# Altium project Elkapod_power_supply_converter_module.PrjPcb (part 1 of 4)
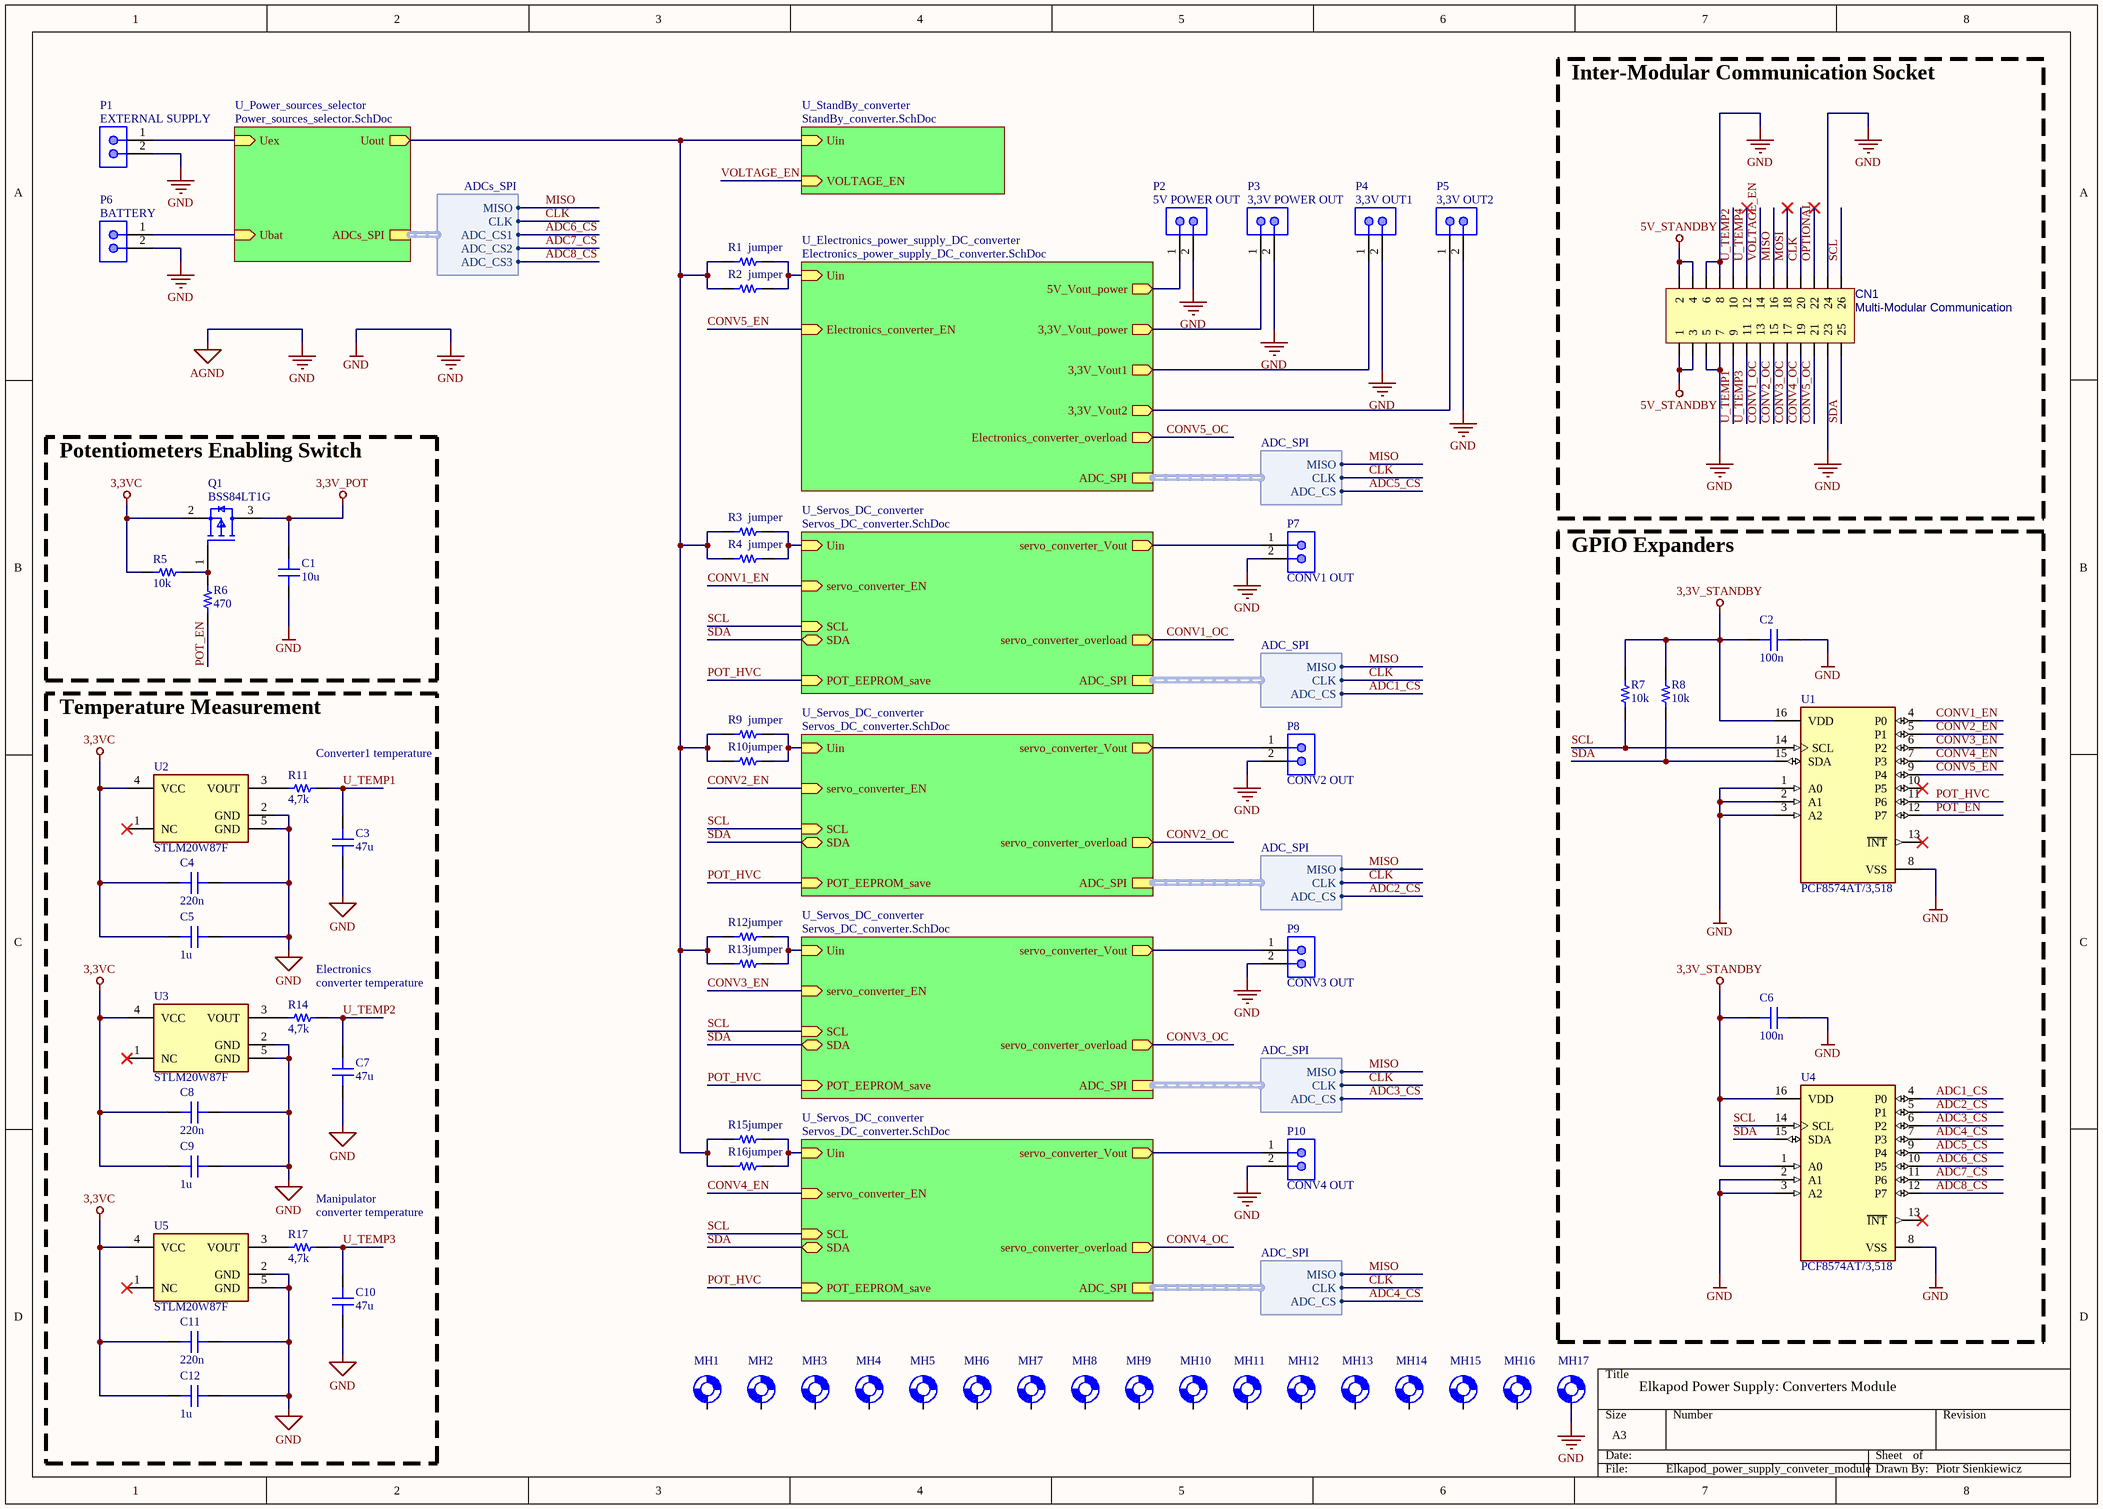
[diagram p0: Elkapod_power_supply_conveter_module.SchDoc]
6 sheets, 606 parts. Net scope: hierarchical (ports join the sheet entries above them; power ports are global).
Board file: Elkapod_power_supply_converter_module_PCB.PcbDoc
Sheets:
  Elkapod_power_supply_conveter_module.SchDoc
    U_Power_sources_selector = Power_sources_selector.SchDoc
      U_Current_measurement_circuit = Current_measurement_circuit.SchDoc
    U_StandBy_converter = StandBy_converter.SchDoc
    U_Servos_DC_converter = Servos_DC_converter.SchDoc
    U_Electronics_power_supply_DC_converter = Electronics_power_supply_DC_converter.SchDoc
    U_Servos_DC_converter = Servos_DC_converter.SchDoc
    U_Servos_DC_converter = Servos_DC_converter.SchDoc
    U_Servos_DC_converter = Servos_DC_converter.SchDoc

## Sheet Elkapod_power_supply_conveter_module.SchDoc: Elkapod Power Supply Block Diagram
size A3; SheetNumber: 1; SheetTotal: 6

### Parts
C1  10u  [CAP 0603_1608]
C2  100n  [CAP 0603_1608]
C3  47u  [CAP 0603_1608]
C4  220n  [CAP 0603_1608]
C5  1u  [CAP 0603_1608]
C6  100n  [CAP 0603_1608]
C7  47u  [CAP 0603_1608]
C8  220n  [CAP 0603_1608]
C9  1u  [CAP 0603_1608]
C10  47u  [CAP 0603_1608]
C11  220n  [CAP 0603_1608]
C12  1u  [CAP 0603_1608]
CN1  Multi-Modular Communication  [GP_13x2_F]
MH1  M3 Mounting Hole  [M3_MOUNTING_HOLE]  (value not drawn)
MH2  M3 Mounting Hole  [M3_MOUNTING_HOLE]  (value not drawn)
MH3  M3 Mounting Hole  [M3_MOUNTING_HOLE]  (value not drawn)
MH4  M3 Mounting Hole  [M3_MOUNTING_HOLE]  (value not drawn)
MH5  M3 Mounting Hole  [M3_MOUNTING_HOLE]  (value not drawn)
MH6  M3 Mounting Hole  [M3_MOUNTING_HOLE]  (value not drawn)
MH7  M3 Mounting Hole  [M3_MOUNTING_HOLE]  (value not drawn)
MH8  M3 Mounting Hole  [M3_MOUNTING_HOLE]  (value not drawn)
MH9  M3 Mounting Hole  [M3_MOUNTING_HOLE]  (value not drawn)
MH10  M3 Mounting Hole  [M3_MOUNTING_HOLE]  (value not drawn)
MH11  M3 Mounting Hole  [M3_MOUNTING_HOLE]  (value not drawn)
MH12  M3 Mounting Hole  [M3_MOUNTING_HOLE]  (value not drawn)
MH13  M3 Mounting Hole  [M3_MOUNTING_HOLE]  (value not drawn)
MH14  M3 Mounting Hole  [M3_MOUNTING_HOLE]  (value not drawn)
MH15  M3 Mounting Hole  [M3_MOUNTING_HOLE]  (value not drawn)
MH16  M3 Mounting Hole  [M3_MOUNTING_HOLE]  (value not drawn)
MH17  M3 Mounting Hole  [M3_MOUNTING_HOLE]  (value not drawn)
P1  EXTERNAL SUPPLY  [XT60PB-M]
P2  5V POWER OUT  [2x2,5mm2_WIRE]
P3  3,3V POWER OUT  [2x2,5mm2_WIRE]
P4  3,3V OUT1  [2x2,5mm2_WIRE]
P5  3,3V OUT2  [2x2,5mm2_WIRE]
P6  BATTERY  [XT60PB-M]
P7  CONV1 OUT  [2x2,5mm2_WIRE]
P8  CONV2 OUT  [2x2,5mm2_WIRE]
P9  CONV3 OUT  [2x2,5mm2_WIRE]
P10  CONV4 OUT  [2x2,5mm2_WIRE]
Q1  BSS84LT1G  [FP-318-08-IPC_A]
R1  jumper  [STACKPOLE CSM2512]
R2  jumper  [STACKPOLE CSM2512]
R3  jumper  [STACKPOLE CSM2512]
R4  jumper  [STACKPOLE CSM2512]
R5  10k  [RES 0603_1608]
R6  470  [RES 0603_1608]
R7  10k  [RES 0603_1608]
R8  10k  [RES 0603_1608]
R9  jumper  [STACKPOLE CSM2512]
R10  jumper  [STACKPOLE CSM2512]
R11  4,7k  [RES 0603_1608]
R12  jumper  [STACKPOLE CSM2512]
R13  jumper  [STACKPOLE CSM2512]
R14  4,7k  [RES 0603_1608]
R15  jumper  [STACKPOLE CSM2512]
R16  jumper  [STACKPOLE CSM2512]
R17  4,7k  [RES 0603_1608]
U1  PCF8574AT/3,518  [FP-SOT162-1-MFG]
U2  STLM20W87F  [FP-SOT323-5L-7091413-MFG]
U3  STLM20W87F  [FP-SOT323-5L-7091413-MFG]
U4  PCF8574AT/3,518  [FP-SOT162-1-MFG]
U5  STLM20W87F  [FP-SOT323-5L-7091413-MFG]

### Blocks framed on the sheet
Inter-Modular Communication Socket: CN1
Potentiometers Enabling Switch: C1 Q1 R5 R6
GPIO Expanders: C2 C6 R7 R8 U1 U4
Temperature Measurement: C3-C5 C7-C12 R11 R14 R17 U2 U3 U5

### Sub-sheets
U_Electronics_power_supply_DC_converter = Electronics_power_supply_DC_converter.SchDoc: Uin (in), Electronics_converter_EN (in), Electronics_converter_overload (out), 3,3V_Vout2 (out), 3,3V_Vout1 (out), 3,3V_Vout_power (out), 5V_Vout_power (out), ADC_SPI (harness ADC_SPI)
U_Power_sources_selector = Power_sources_selector.SchDoc: Ubat (in), Uout (out), Uex (in), ADCs_SPI (harness ADCs_SPI)
U_Servos_DC_converter = Servos_DC_converter.SchDoc: Uin (in), servo_converter_EN (in), servo_converter_overload (out), servo_converter_Vout (out), POT_EEPROM_save (in), SDA (bidir), SCL (in), ADC_SPI (harness ADC_SPI)  | RF2_value: 2,7k; RF1_value: 1k; RF3_value: 910
U_Servos_DC_converter = Servos_DC_converter.SchDoc: Uin (in), servo_converter_EN (in), servo_converter_overload (out), servo_converter_Vout (out), POT_EEPROM_save (in), SDA (bidir), SCL (in), ADC_SPI (harness ADC_SPI)  | RF2_value: 2,7k; RF1_value: 1k; RF3_value: 910
U_Servos_DC_converter = Servos_DC_converter.SchDoc: Uin (in), servo_converter_EN (in), servo_converter_overload (out), servo_converter_Vout (out), POT_EEPROM_save (in), SDA (bidir), SCL (in), ADC_SPI (harness ADC_SPI)  | RF2_value: 2,7k; RF1_value: 1k; RF3_value: 910
U_Servos_DC_converter = Servos_DC_converter.SchDoc: Uin (in), servo_converter_EN (in), servo_converter_overload (out), servo_converter_Vout (out), POT_EEPROM_save (in), SDA (bidir), SCL (in), ADC_SPI (harness ADC_SPI)  | RF2_value: 6,8k; RF1_value: 3,3k; RF3_value: 1,3k
U_StandBy_converter = StandBy_converter.SchDoc: Uin (in), VOLTAGE_EN (in)

### Harnesses
ADC_SPI: MISO, CLK, ADC_CS
ADCs_SPI: MISO, CLK, ADC_CS1, ADC_CS2, ADC_CS3

### Nets
3,3V_POT: C1.2 Q1.3(D)
3,3V_STANDBY: C2.2 C6.2 R7.2 R8.2 U1.16(VDD) U4.1(A0) U4.16(VDD)
3,3VC: C4.2 C5.2 C8.2 C9.2 C11.2 C12.2 Q1.2(S) R5.1 U2.4(VCC) U3.4(VCC) U5.4(VCC)
5V_STANDBY: CN1.1 CN1.2 CN1.3 CN1.4
AGND: C1.1 C2.1 C3.1 C4.1 C5.1 C6.1 C7.1 C8.1 C9.1 C10.1 C11.1 C12.1 CN1.5 CN1.6 CN1.7 CN1.8 CN1.23 CN1.24 MH17.1 P1.2(-) P2.2(-) P3.2(-) P4.2(-) P5.2(-) P6.2(-) P7.2(-) P8.2(-) P9.2(-) P10.2(-) U1.1(A0) U1.2(A1) U1.3(A2) U1.8(VSS) U2.2(GND) U2.5(GND) U3.2(GND) U3.5(GND) U4.2(A1) U4.3(A2) U4.8(VSS) U5.2(GND) U5.5(GND)  [also labelled GND]
5V_Vout_power: P2.1(+) ; sheet U_Electronics_power_supply_DC_converter/5V_Vout_power
ADC1_CS: U4.4(P0) ; sheet U_Servos_DC_converter/ADC_SPI.ADC_CS
ADC2_CS: U4.5(P1) ; sheet U_Servos_DC_converter/ADC_SPI.ADC_CS
ADC3_CS: U4.6(P2) ; sheet U_Servos_DC_converter/ADC_SPI.ADC_CS
ADC4_CS: U4.7(P3) ; sheet U_Servos_DC_converter/ADC_SPI.ADC_CS
ADC5_CS: U4.9(P4) ; sheet U_Electronics_power_supply_DC_converter/ADC_SPI.ADC_CS
ADC6_CS: U4.10(P5) ; sheet U_Power_sources_selector/ADCs_SPI.ADC_CS1
ADC7_CS: U4.11(P6) ; sheet U_Power_sources_selector/ADCs_SPI.ADC_CS2
ADC8_CS: U4.12(P7) ; sheet U_Power_sources_selector/ADCs_SPI.ADC_CS3
CLK: CN1.20 ; sheet U_Electronics_power_supply_DC_converter/ADC_SPI.CLK, sheet U_Servos_DC_converter/ADC_SPI.CLK, sheet U_Power_sources_selector/ADCs_SPI.CLK
CONV1_EN: U1.4(P0) ; sheet U_Servos_DC_converter/servo_converter_EN
CONV1_OC: CN1.13 ; sheet U_Servos_DC_converter/servo_converter_overload
CONV2_EN: U1.5(P1) ; sheet U_Servos_DC_converter/servo_converter_EN
CONV2_OC: CN1.15 ; sheet U_Servos_DC_converter/servo_converter_overload
CONV3_EN: U1.6(P2) ; sheet U_Servos_DC_converter/servo_converter_EN
CONV3_OC: CN1.17 ; sheet U_Servos_DC_converter/servo_converter_overload
CONV4_EN: U1.7(P3) ; sheet U_Servos_DC_converter/servo_converter_EN
CONV4_OC: CN1.19 ; sheet U_Servos_DC_converter/servo_converter_overload
CONV5_EN: U1.9(P4) ; sheet U_Electronics_power_supply_DC_converter/Electronics_converter_EN
CONV5_OC: CN1.21 ; sheet U_Electronics_power_supply_DC_converter/Electronics_converter_overload
MISO: CN1.16 ; sheet U_Electronics_power_supply_DC_converter/ADC_SPI.MISO, sheet U_Servos_DC_converter/ADC_SPI.MISO, sheet U_Power_sources_selector/ADCs_SPI.MISO
MOSI: CN1.18  [project net MOSI_1]
OPTIONAL: CN1.22  [project net OPTIONAL_1]
POT_EN: R6.2 U1.12(P7)  [project net POT_EN_1]
POT_HVC: U1.11(P6) ; sheet U_Servos_DC_converter/POT_EEPROM_save, sheet U_Servos_DC_converter/POT_EEPROM_save, sheet U_Servos_DC_converter/POT_EEPROM_save, sheet U_Servos_DC_converter/POT_EEPROM_save
SCL: CN1.26 R7.1 U1.14(SCL) U4.14(SCL) ; sheet U_Servos_DC_converter/SCL, sheet U_Servos_DC_converter/SCL, sheet U_Servos_DC_converter/SCL, sheet U_Servos_DC_converter/SCL
SDA: CN1.25 R8.1 U1.15(SDA) U4.15(SDA) ; sheet U_Servos_DC_converter/SDA, sheet U_Servos_DC_converter/SDA, sheet U_Servos_DC_converter/SDA, sheet U_Servos_DC_converter/SDA
servo_converter_Vout: P7.1(+) ; sheet U_Servos_DC_converter/servo_converter_Vout
servo_converter_Vout: P8.1(+) ; sheet U_Servos_DC_converter/servo_converter_Vout  [a separate net that carries the same name]
servo_converter_Vout: P9.1(+) ; sheet U_Servos_DC_converter/servo_converter_Vout  [a separate net that carries the same name]
servo_converter_Vout: P10.1(+) ; sheet U_Servos_DC_converter/servo_converter_Vout  [a separate net that carries the same name]
U_SUP: R1.2 R2.2 R3.2 R4.2 R9.2 R10.2 R12.2 R13.2 R15.2 R16.2 ; sheet U_Power_sources_selector/Uout, sheet U_StandBy_converter/Uin
U_TEMP1: C3.2 CN1.9 R11.2  [project net U_TEMP1_1]
U_TEMP2: C7.2 CN1.10 R14.2  [project net U_TEMP2_1]
U_TEMP3: C10.2 CN1.11 R17.2  [project net U_TEMP3_1]
U_TEMP4: CN1.12  [project net U_TEMP4_1]
Uin: R1.1 R2.1 ; sheet U_Electronics_power_supply_DC_converter/Uin
Uin: R3.1 R4.1 ; sheet U_Servos_DC_converter/Uin  [a separate net that carries the same name]
Uin: R9.1 R10.1 ; sheet U_Servos_DC_converter/Uin  [a separate net that carries the same name]
Uin: R12.1 R13.1 ; sheet U_Servos_DC_converter/Uin  [a separate net that carries the same name]
Uin: R15.1 R16.1 ; sheet U_Servos_DC_converter/Uin  [a separate net that carries the same name]
VOLTAGE_EN: CN1.14 ; sheet U_StandBy_converter/VOLTAGE_EN
NetC47_2: P3.1(+) ; sheet U_Electronics_power_supply_DC_converter/3,3V_Vout_power
NetC52_2: P4.1(+) ; sheet U_Electronics_power_supply_DC_converter/3,3V_Vout1
NetC57_2: P5.1(+) ; sheet U_Electronics_power_supply_DC_converter/3,3V_Vout2
NetF2_1: P1.1(+) ; sheet U_Power_sources_selector/Uex
NetF3_1: P6.1(+) ; sheet U_Power_sources_selector/Ubat
NetQ1_1: Q1.1(G) R5.2 R6.1
NetR11_1: R11.1 U2.3(VOUT)
NetR14_1: R14.1 U3.3(VOUT)
NetR17_1: R17.1 U5.3(VOUT)

Not connected (* = marked no-connect by the designer): MH1 1; MH2 1; MH3 1; MH4 1; MH5 1; MH6 1; MH7 1; MH8 1; MH9 1; MH10 1; MH11 1; MH12 1; MH13 1; MH14 1; MH15 1; MH16 1; U1 10(P5)* 13(~{INT})*; U2 1(NC)*; U3 1(NC)*; U4 13(~{INT})*; U5 1(NC)*

### Notes on the sheet
- (near R11) Converter1 temperature
- (near R14) converter temperature
- (near R14) Electronics
- (near R17) converter temperature
- (near R17) Manipulator
- Elkapod Power Supply: Converters Module
- Piotr Sienkiewicz

### Library data of the parts
C1 = C0603C272F3GAC7867: CAP CER 10uF 35V X5R 0603; manufacturer: KEMET; Temperature Coefficient: C0G, NP0; Tolerance: ±1%; Voltage - Rated: 25V; Part Number: C0603C272F3GAC7867; Value: 10u; Applications: General Purpose; Capacitance: 10u; componentlink1description: Datasheet; componentlink1url: https://api.kemet.com/component-edge/download/datasheet/C0603C272F3GACTU.pdf; componentlink2description: DigiKey Link; componentlink2url: https://www.digikey.com/en/products/detail/kemet/C0603C272F3GAC7867/2200413; Device Package: 0603 (1608 Metric); Features: Low ESL; lastupdated: 09.02.2024 20:10:30; Lifecycle Status: Active; Minimum Order: 1; Mounting Type: Surface Mount, MLCC; Operating Temperature: -55°C ~ 125°C; Package / Case: 0603 (1608 Metric); packaging: TapeAndReel; partid: 2138; Part Status: Active; price: 0.40; series: SMD Comm C0G; Size / Dimension: 0.063" L x 0.031" W (1.60mm x 0.80mm); Thickness (Max): 0.034" (0.87mm)
C2 C6 = C0603C272F3GAC7867: CAP CER 100nF 25V X5R 0603; manufacturer: KEMET; Temperature Coefficient: C0G, NP0; Tolerance: ±1%; Part Number: C0603C272F3GAC7867; Value: 100n; Applications: General Purpose; Capacitance: 100n; componentlink1description: Datasheet; componentlink1url: https://api.kemet.com/component-edge/download/datasheet/C0603C272F3GACTU.pdf; componentlink2description: DigiKey Link; componentlink2url: https://www.digikey.com/en/products/detail/kemet/C0603C272F3GAC7867/2200413; Device Package: 0603 (1608 Metric); Features: Low ESL; lastupdated: 09.02.2024 20:10:30; Lifecycle Status: Active; Minimum Order: 1; Mounting Type: Surface Mount, MLCC; Operating Temperature: -55°C ~ 125°C; Package / Case: 0603 (1608 Metric); packaging: TapeAndReel; partid: 2138; Part Status: Active; price: 0.40; series: SMD Comm C0G; Size / Dimension: 0.063" L x 0.031" W (1.60mm x 0.80mm); Thickness (Max): 0.034" (0.87mm); Voltage - Rated: 25V
C3 C7 C10 = C0603C272F3GAC7867: CAP CER 47uF 6,3V X5R 0603; manufacturer: KEMET; Temperature Coefficient: C0G, NP0; Tolerance: ±1%; Voltage - Rated: 25V; Part Number: C0603C272F3GAC7867; Value: 47u; Applications: General Purpose; Capacitance: 47u; componentlink1description: Datasheet; componentlink1url: https://api.kemet.com/component-edge/download/datasheet/C0603C272F3GACTU.pdf; componentlink2description: DigiKey Link; componentlink2url: https://www.digikey.com/en/products/detail/kemet/C0603C272F3GAC7867/2200413; Device Package: 0603 (1608 Metric); Features: Low ESL; lastupdated: 09.02.2024 20:10:30; Lifecycle Status: Active; Minimum Order: 1; Mounting Type: Surface Mount, MLCC; Operating Temperature: -55°C ~ 125°C; Package / Case: 0603 (1608 Metric); packaging: TapeAndReel; partid: 2138; Part Status: Active; price: 0.40; series: SMD Comm C0G; Size / Dimension: 0.063" L x 0.031" W (1.60mm x 0.80mm); Thickness (Max): 0.034" (0.87mm)
C4 C8 C11 = C0603C272F3GAC7867: CAP CER 220nF 25V X5R 0603; manufacturer: KEMET; Temperature Coefficient: C0G, NP0; Tolerance: ±1%; Part Number: C0603C272F3GAC7867; Value: 220n; Applications: General Purpose; Capacitance: 220n; componentlink1description: Datasheet; componentlink1url: https://api.kemet.com/component-edge/download/datasheet/C0603C272F3GACTU.pdf; componentlink2description: DigiKey Link; componentlink2url: https://www.digikey.com/en/products/detail/kemet/C0603C272F3GAC7867/2200413; Device Package: 0603 (1608 Metric); Features: Low ESL; lastupdated: 09.02.2024 20:10:30; Lifecycle Status: Active; Minimum Order: 1; Mounting Type: Surface Mount, MLCC; Operating Temperature: -55°C ~ 125°C; Package / Case: 0603 (1608 Metric); packaging: TapeAndReel; partid: 2138; Part Status: Active; price: 0.40; series: SMD Comm C0G; Size / Dimension: 0.063" L x 0.031" W (1.60mm x 0.80mm); Thickness (Max): 0.034" (0.87mm); Voltage - Rated: 25V
C5 C9 C12 = C0603C272F3GAC7867: CAP CER 1uF 25V X5R 0603; manufacturer: KEMET; Temperature Coefficient: C0G, NP0; Tolerance: ±1%; Part Number: C0603C272F3GAC7867; Value: 1u; Applications: General Purpose; Capacitance: 1u; componentlink1description: Datasheet; componentlink1url: https://api.kemet.com/component-edge/download/datasheet/C0603C272F3GACTU.pdf; componentlink2description: DigiKey Link; componentlink2url: https://www.digikey.com/en/products/detail/kemet/C0603C272F3GAC7867/2200413; Device Package: 0603 (1608 Metric); Features: Low ESL; lastupdated: 09.02.2024 20:10:30; Lifecycle Status: Active; Minimum Order: 1; Mounting Type: Surface Mount, MLCC; Operating Temperature: -55°C ~ 125°C; Package / Case: 0603 (1608 Metric); packaging: TapeAndReel; partid: 2138; Part Status: Active; price: 0.40; series: SMD Comm C0G; Size / Dimension: 0.063" L x 0.031" W (1.60mm x 0.80mm); Thickness (Max): 0.034" (0.87mm); Voltage - Rated: 25V
CN1 = CN_13x2
P1 P6 = XT60PB-M: XT60UPB-M; 30A/500V straight female DC PCB socket (pin1 -> +, pin2 -> -)
P2-P5 P7-P10 = 2X2,5mm2_WIRE: 2x2,5mm2 wire pads
Q1 = CMP-1058-00762-2: MOSFET P-CH 50V 130MA SOT-23; Max Power Dissipation: 225mW; On-State Resistance: 10R; Nominal Vgs: 2V; Gate to Source Voltage (Vgs): 20V; Rise Time: 1ns; Turn-Off Delay Time: 16ns; Voltage Rating (DC): -50V; Turn-On Delay Time: 3.6ns; Number of Elements: 1; Current Rating: -130mA; Input Capacitance: 30pF; Threshold Voltage: -2V; Element Configuration: Single; Drain to Source Breakdown Voltage: 50V; Continuous Drain Current (ID): 130mA; Length: 0.119inch; Drain to Source Voltage (Vdss): 50V; Min Operating Temperature: -55°C; Contact Plating: Tin; Lead Free: Lead Free; Width: 0.055inch; Case/Package: SOT-23-3; Max Operating Temperature: 150°C; Halogen Free: Halogen Free; Radiation Hardening: No; Drain to Source Resistance: 10R; REACH SVHC: No SVHC; Power Dissipation: 225mW; Number of Pins: 3; Package Quantity: 1; Packaging: Tape and Reel; Fall Time: 1ns; Rds On Max: 10R; Height: 0.04inch
R1-R4 R9 R10 R12 R13 R15 R16 = CSM2512FT20L0: RES 0 OHM 1W 2512; manufacturer: Stackpole Electronics Inc; Power (Watts): 3W; Temperature Coefficient: ±50ppm/°C; Tolerance: ±1%; value: 20 mOhms; Part Number: CSM2512FT20L0; componentlink1description: Datasheet; componentlink1url: https://www.seielect.com/Catalog/SEI-CSM.PDF; componentlink2description: DigiKey Link; componentlink2url: https://www.digikey.com/en/products/detail/stackpole-electronics-inc/CSM2512FT20L0/6270239; Composition: Metal Element; Device Package: 2512 (6332 Metric); Features: Current Sense; Height - Seated (Max): 0.035" (0.90mm); lastupdated: 03.06.2024 20:27:03; Lifecycle Status: Active; Minimum Order: 4000; Number of Terminations: 2; Operating Temperature: -55°C ~ 170°C; Package / Case: 2512 (6332 Metric); packaging: TapeAndReel; Part Status: Active; price: 0.19; Resistance: jumper; series: CSM; Size / Dimension: 0.252" L x 0.126" W (6.40mm x 3.20mm); Supplier Device Package: 2512
R5 R7 R8 = RNCS0603BKE10K0: RES 10K OHM 1% 0,1W 0603; Manufacturer: Stackpole Electronics Inc; Power (Watts): 0.063W, 1/16W; Temperature Coefficient: ±25ppm/°C; Tolerance: ±0.1%; Part Number: RNCS0603BKE10K0; Value: 10k; Composition: Thin Film; Device Package: 0603 (1608 Metric); Features: Anti-Corrosive, Automotive AEC-Q200, Moisture Resistant; Height - Seated (Max): 0.022" (0.55mm); LastUpdated: 09.02.2024 20:43:37; Lifecycle Status: Active; Minimum Order: 1; Number of Terminations: 2; Operating Temperature: -55°C ~ 155°C; Package / Case: 0603 (1608 Metric); Packaging: TapeAndReel; PartId: 4838; Part Status: Active; Price: 0.06; Ratings: AEC-Q200; Resistance: 10k; Series: RNCS; Size / Dimension: 0.061" L x 0.031" W (1.55mm x 0.80mm); Supplier Device Package: 0603
R6 = RNCS0603BKE10K0: RES 470 OHM 1% 0,1W 0603; Manufacturer: Stackpole Electronics Inc; Power (Watts): 0.063W, 1/16W; Temperature Coefficient: ±25ppm/°C; Tolerance: ±0.1%; Part Number: RNCS0603BKE10K0; Value: 470; Composition: Thin Film; Device Package: 0603 (1608 Metric); Features: Anti-Corrosive, Automotive AEC-Q200, Moisture Resistant; Height - Seated (Max): 0.022" (0.55mm); LastUpdated: 09.02.2024 20:43:37; Lifecycle Status: Active; Minimum Order: 1; Number of Terminations: 2; Operating Temperature: -55°C ~ 155°C; Package / Case: 0603 (1608 Metric); Packaging: TapeAndReel; PartId: 4838; Part Status: Active; Price: 0.06; Ratings: AEC-Q200; Resistance: 470; Series: RNCS; Size / Dimension: 0.061" L x 0.031" W (1.55mm x 0.80mm); Supplier Device Package: 0603
R11 R14 R17 = RNCS0603BKE10K0: RES 4,7K OHM 1% 0,1W 0603; Manufacturer: Stackpole Electronics Inc; Power (Watts): 0.063W, 1/16W; Temperature Coefficient: ±25ppm/°C; Tolerance: ±0.1%; Part Number: RNCS0603BKE10K0; Value: 4,7k; Composition: Thin Film; Device Package: 0603 (1608 Metric); Features: Anti-Corrosive, Automotive AEC-Q200, Moisture Resistant; Height - Seated (Max): 0.022" (0.55mm); LastUpdated: 09.02.2024 20:43:37; Lifecycle Status: Active; Minimum Order: 1; Number of Terminations: 2; Operating Temperature: -55°C ~ 155°C; Package / Case: 0603 (1608 Metric); Packaging: TapeAndReel; PartId: 4838; Part Status: Active; Price: 0.06; Ratings: AEC-Q200; Resistance: 4,7k; Series: RNCS; Size / Dimension: 0.061" L x 0.031" W (1.55mm x 0.80mm); Supplier Device Package: 0603
U1 U4 = CMP-10112-000003-1: IC I/O EXPANDER I2C 8B 16SOIC; Manufacturer: NXP Semiconductors; Interface: I2C,SMBus; Frequency: 100kHz; Nominal Supply Current: 40uA; Max Supply Voltage: 6V; Number Of I/Os: 8; Max Junction Temp: +125°C; Min Supply Voltage: 2.5V; Standoff Height: 0.1mm; RoHS: TRUE; Category: IC; Temperature: -40°C to +85°C; Device Class L3: I/O Expanders; ComponentLink2Description: Datasheet; ComponentLink2URL: https://www.nxp.com/docs/en/data-sheet/PCF8574_PCF8574A.pdf; Digikey Description: IC I/O EXPANDER I2C 8B 16SOIC; Ipc Land Pattern Name: SOIC127P1032X265-16; Mouser Description: PCF8574 Series 2.5 to 6V Remote 8-bit I/O Expander for I2C-bus -SOIC-16; Footprint Url: https://www.nxp.com/docs/en/package-information/SOT162-1.pdf; Lead Free: Yes; Device Class L2: Interface ICs; Ambient Temperature Range Low: -40°C; Temperature Range High: +85°C; Automotive: No; Manufacturer Part Number: PCF8574AT/3,518; Ambient Temperature Range High: +85°C; Height: 2.65mm; Package: SOT162-1; Temperature Range Low: -40°C; Octopart: https://octopart.com/pcf8574at%2F3%2C518-nxp+semiconductors-11541925; Device Class L1: Integrated Circuits (ICs)
U2 U3 U5 = CMP-12184-000003-1: SENSOR ANALOG -55C-130C SOT323-5; Manufacturer: STMicroelectronics; Max Junction Temp: +150°C; Standoff Height: 0mm; Operating Supply Current: 4.8uA; Max Supply Voltage: 5.5V; Output Current: 10mA; Sensor Output: Analog Voltage; Min Supply Voltage: 2.4V; Output Voltage: 1.8639V; Temperature Range High: +130°C; Digikey Description: SENSOR ANALOG -55C-130C SOT323-5; Temperature: -55°C to +130°C; Mouser Description: Temperature Sensor Ic, Voltage, 1.5 C, -55 C, +130 C, Sc-70, 5 Rohs Compliant: Yes; Device Class L3: unset; Category: IC; Device Class L1: Sensors; Lead Free: Yes; ComponentLink2URL: https://www.st.com/resource/en/datasheet/stlq020.pdf; Package: SOT323-5L-7091413; Temperature Range Low: -55°C; Ambient Temperature Range Low: -55°C; Automotive: No; Manufacturer Part Number: STLM20W87F; Ambient Temperature Range High: +130°C; RoHS: TRUE; Octopart: https://octopart.com/stlm20w87f-stmicroelectronics-4006294; Height: 1.1mm; ComponentLink2Description: Datasheet; Ipc Land Pattern Name: SOT65P210X95-5; Device Class L2: Temperature and Humidity Sensors

## Sheet Power_sources_selector.SchDoc
size A4; SheetNumber: 5; SheetTotal: 6
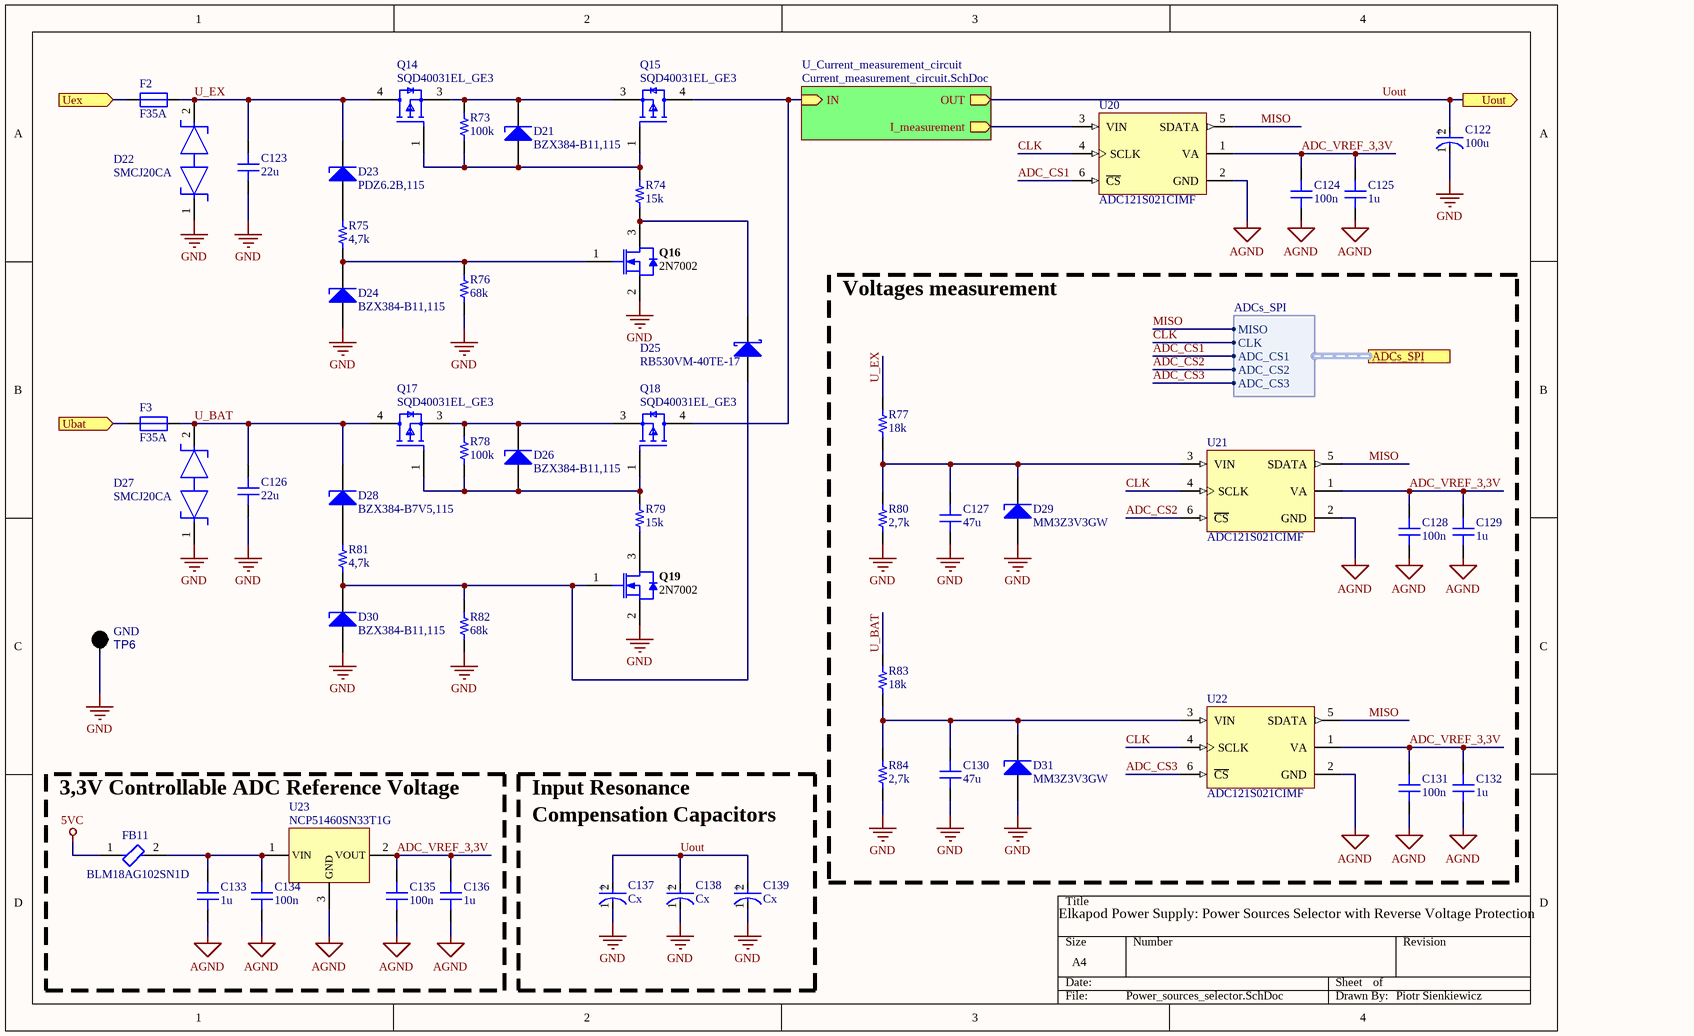
[diagram p1: Power_sources_selector.SchDoc]

### Parts
C122  100u  [FP-FKE-MFG]
C123  22u  [CAP 0805_2012]
C124  100n  [CAP 0603_1608]
C125  1u  [CAP 0603_1608]
C126  22u  [CAP 0805_2012]
C127  47u  [CAP 0603_1608]
C128  100n  [CAP 0603_1608]
C129  1u  [CAP 0603_1608]
C130  47u  [CAP 0603_1608]
C131  100n  [CAP 0603_1608]
C132  1u  [CAP 0603_1608]
C133  1u  [CAP 0603_1608]
C134  100n  [CAP 0603_1608]
C135  100n  [CAP 0603_1608]
C136  1u  [CAP 0603_1608]
C137  Cx  [FP-FKE-MFG]
C138  Cx  [FP-FKE-MFG]
C139  Cx  [FP-FKE-MFG]
D21  BZX384-B11,115  [SOD323]
D22  SMCJ20CA  [FP-SMC-CA-MFG]
D23  PDZ6.2B,115  [SOD323]
D24  BZX384-B11,115  [SOD323]
D25  RB530VM-40TE-17  [SOD-323]
D26  BZX384-B11,115  [SOD323]
D27  SMCJ20CA  [FP-SMC-CA-MFG]
D28  BZX384-B7V5,115  [SOD323]
D29  MM3Z3V3GW  [SOD323]
D30  BZX384-B11,115  [SOD323]
D31  MM3Z3V3GW  [SOD323]
F2  F35A  [6,3x32_fuse_PCB]
F3  F35A  [6,3x32_fuse_PCB]
FB11  BLM18AG102SN1D  [FP-BLM18-0_15-t0_8-MFG]
Q14  SQD40031EL_GE3  [FP-T13-0592-MFG]
Q15  SQD40031EL_GE3  [FP-T13-0592-MFG]
Q16  2N7002  [INF-PG-SOT23_M]
Q17  SQD40031EL_GE3  [FP-T13-0592-MFG]
Q18  SQD40031EL_GE3  [FP-T13-0592-MFG]
Q19  2N7002  [INF-PG-SOT23_M]
R73  100k  [RES 0603_1608]
R74  15k  [RES 0603_1608]
R75  4,7k  [RES 0603_1608]
R76  68k  [RES 0603_1608]
R77  18k  [RES 0603_1608]
R78  100k  [RES 0603_1608]
R79  15k  [RES 0603_1608]
R80  2,7k  [RES 0603_1608]
R81  4,7k  [RES 0603_1608]
R82  68k  [RES 0603_1608]
R83  18k  [RES 0603_1608]
R84  2,7k  [RES 0603_1608]
TP6  GND  [Keystone_5006_BLACK]
U20  ADC121S021CIMF  [DBV0006A_M]
U21  ADC121S021CIMF  [DBV0006A_M]
U22  ADC121S021CIMF  [DBV0006A_M]
U23  NCP51460SN33T1G  [SOT23-3]

### Blocks framed on the sheet
Voltages measurement: C127-C132 D29 D31 R77 R80 R83 R84 U21 U22
3,3V Controllable ADC Reference Voltage: C133-C136 FB11 U23

### Sub-sheets
U_Current_measurement_circuit = Current_measurement_circuit.SchDoc: I_measurement (out), IN (in), OUT (out)  | Rsense_value: 0,5m

### Ports
ADCs_SPI (harness ADCs_SPI, see Elkapod_power_supply_conveter_module[2A]), Ubat (in, see Elkapod_power_supply_conveter_module[1A]), Uex (in, see Elkapod_power_supply_conveter_module[1A]), Uout (out, see Elkapod_power_supply_conveter_module[2A])

### Harnesses
ADCs_SPI: MISO, CLK, ADC_CS1, ADC_CS2, ADC_CS3

### Nets
5VC: FB11.1
AGND: C122.1(C) C123.1 C124.1 C125.1 C126.1 C127.1 C128.1 C129.1 C130.1 C131.1 C132.1 C133.1 C134.1 C135.1 C136.1 C137.1(C) C138.1(C) C139.1(C) D22.1 D24.1(A) D27.1 D29.1(A) D30.1(A) D31.1(A) Q16.2(SOURCE) Q19.2(SOURCE) R76.1 R80.2 R82.1 R84.2 TP6.0 U20.2(GND) U21.2(GND) U22.2(GND) U23.3(GND)  [also labelled GND]
ADC_CS1: U20.6(~{CS}) ; port ADCs_SPI.ADC_CS1  [project net ADC6_CS]
ADC_CS2: U21.6(~{CS}) ; port ADCs_SPI.ADC_CS2  [project net ADC7_CS]
ADC_CS3: U22.6(~{CS}) ; port ADCs_SPI.ADC_CS3  [project net ADC8_CS]
ADC_VREF_3,3V: C124.2 C125.2 C128.2 C129.2 C131.2 C132.2 C135.2 C136.2 U20.1(VA) U21.1(VA) U22.1(VA) U23.2(VOUT)  [project net ADC_VREF_3,3V_5]
CLK: U20.4(SCLK) U21.4(SCLK) U22.4(SCLK) ; port ADCs_SPI.CLK
MISO: U20.5(SDATA) U21.5(SDATA) U22.5(SDATA) ; port ADCs_SPI.MISO
U_BAT: C126.2 D27.2 D28.2(K) F3.2 Q17.4(D) R83.1  [project net U_BAT_5]
U_EX: C123.2 D22.2 D23.2(K) F2.2 Q14.4(D) R77.1  [project net U_EX_5]
Uout: C122.2(A) C137.2(A) C138.2(A) C139.2(A) ; port Uout, sheet U_Current_measurement_circuit/OUT  [project net U_SUP]
NetC127_2: C127.2 D29.2(K) R77.2 R80.1 U21.3(VIN)
NetC130_2: C130.2 D31.2(K) R83.2 R84.1 U22.3(VIN)
NetC133_2: C133.2 C134.2 FB11.2 U23.1(VIN)
NetC140_2: U20.3(VIN) ; sheet U_Current_measurement_circuit/I_measurement
NetD21_1: D21.1(A) Q14.1(G) Q15.1(G) R73.1 R74.2
NetD21_2: D21.2(K) Q14.3(S) Q15.3(S) R73.2
NetD23_1: D23.1(A) R75.2
NetD24_2: D24.2(K) Q16.1(GATE) R75.1 R76.2
NetD25_1: D25.1(K) Q16.3(DRAIN) R74.1
NetD25_2: D25.2(A) D30.2(K) Q19.1(GATE) R81.1 R82.2
NetD26_1: D26.1(A) Q17.1(G) Q18.1(G) R78.1 R79.2
NetD26_2: D26.2(K) Q17.3(S) Q18.3(S) R78.2
NetD28_1: D28.1(A) R81.2
NetF2_1: F2.1 ; port Uex
NetF3_1: F3.1 ; port Ubat
NetQ15_4: Q15.4(D) Q18.4(D) ; sheet U_Current_measurement_circuit/IN
NetQ19_3: Q19.3(DRAIN) R79.1

### Notes on the sheet
- Input Resonance
- Compensation Capacitors
- Elkapod Power Supply: Power Sources Selector with Reverse Voltage Protection
- Piotr Sienkiewicz
- (in symbol CMP-2000-06205-2) +

### Library data of the parts
C122 = CMP-2000-06205-2: CAP ALUM 100UF 20% 25V SMD; Ripple Current (AC): 300mA; Leakage Current: 3uA; Dielectric Material: Aluminium; Impedance: 260mR; Life (Hours): 2000Hour; Max Operating Temperature: 105°C; Voltage Rating (DC): 25V; Packaging: Tape and Reel; Min Operating Temperature: -55°C; Capacitance: 100uF; Ripple Current: 300mA; Mount: Surface Mount; Lead Free: Lead Free; Construction: Cylindrical; Voltage Rating: 25V; RoHS Compliant: Yes; Case/Package: Radial; Height: 6.2mm; Tolerance: 20%; Diameter: 8mm; Termination: SMD/SMT; Package Quantity: 1; Width: 8.3mm; REACH SVHC: No SVHC; Series: FK; Number of Pins: 2; Voltage: 25V; Radiation Hardening: No; Height - Seated (Max): 0.244inch; Length: 6.2mm; ESR (Equivalent Series Resistance): 260mR
C123 C126 = VJ0805Y684KXQTW1BC: CAP CER 22UF 25V X7R 0805; manufacturer: Vishay Vitramon; Tolerance: ±10%; Voltage - Rated: 10V; Part Number: VJ0805Y684KXQTW1BC; Value: 22u; Applications: General Purpose; Capacitance: 22u; componentlink1description: Datasheet; componentlink1url: https://www.vishay.com/docs/28548/vjw1bcbascomseries.pdf; componentlink2description: DigiKey Link; componentlink2url: https://www.digikey.com/en/products/detail/vishay-vitramon/VJ0805Y684KXQTW1BC/8313569; Device Package: 0805 (2012 Metric); lastupdated: 09.02.2024 20:13:13; Lifecycle Status: Active; Minimum Order: 1; Mounting Type: Surface Mount, MLCC; Operating Temperature: -55°C ~ 125°C; Package / Case: 0805 (2012 Metric); packaging: TapeAndReel; partid: 57262; price: 0.05; series: VJ W1BC; Size / Dimension: 0.079" L x 0.049" W (2.00mm x 1.25mm); Temperature Coefficient: X7R; Thickness (Max): 0.053" (1.35mm)
C124 C128 C131 C134 C135 = C0603C272F3GAC7867: as C2 on sheet Elkapod_power_supply_conveter_module; Part Number: C0603C272F3GAC7867; Value: 100n; Applications: General Purpose; Capacitance: 100n; componentlink1description: Datasheet; componentlink1url: https://api.kemet.com/component-edge/download/datasheet/C0603C272F3GACTU.pdf; componentlink2description: DigiKey Link; componentlink2url: https://www.digikey.com/en/products/detail/kemet/C0603C272F3GAC7867/2200413; Device Package: 0603 (1608 Metric); Features: Low ESL; lastupdated: 09.02.2024 20:10:30; Lifecycle Status: Active; Minimum Order: 1; Mounting Type: Surface Mount, MLCC; Operating Temperature: -55°C ~ 125°C; Package / Case: 0603 (1608 Metric); packaging: TapeAndReel; partid: 2138; Part Status: Active; price: 0.40; series: SMD Comm C0G; Size / Dimension: 0.063" L x 0.031" W (1.60mm x 0.80mm); Thickness (Max): 0.034" (0.87mm); Voltage - Rated: 25V
C125 C129 C132 C133 C136 = C0603C272F3GAC7867: CAP CER 1uF 16V X5R 0603; manufacturer: KEMET; Temperature Coefficient: C0G, NP0; Tolerance: ±1%; Voltage - Rated: 25V; Part Number: C0603C272F3GAC7867; Value: 1u; Applications: General Purpose; Capacitance: 1u; componentlink1description: Datasheet; componentlink1url: https://api.kemet.com/component-edge/download/datasheet/C0603C272F3GACTU.pdf; componentlink2description: DigiKey Link; componentlink2url: https://www.digikey.com/en/products/detail/kemet/C0603C272F3GAC7867/2200413; Device Package: 0603 (1608 Metric); Features: Low ESL; lastupdated: 09.02.2024 20:10:30; Lifecycle Status: Active; Minimum Order: 1; Mounting Type: Surface Mount, MLCC; Operating Temperature: -55°C ~ 125°C; Package / Case: 0603 (1608 Metric); packaging: TapeAndReel; partid: 2138; Part Status: Active; price: 0.40; series: SMD Comm C0G; Size / Dimension: 0.063" L x 0.031" W (1.60mm x 0.80mm); Thickness (Max): 0.034" (0.87mm)
C127 C130 = C0603C272F3GAC7867: as C3 on sheet Elkapod_power_supply_conveter_module; Part Number: C0603C272F3GAC7867; Value: 47u; Applications: General Purpose; Capacitance: 47u; componentlink1description: Datasheet; componentlink1url: https://api.kemet.com/component-edge/download/datasheet/C0603C272F3GACTU.pdf; componentlink2description: DigiKey Link; componentlink2url: https://www.digikey.com/en/products/detail/kemet/C0603C272F3GAC7867/2200413; Device Package: 0603 (1608 Metric); Features: Low ESL; lastupdated: 09.02.2024 20:10:30; Lifecycle Status: Active; Minimum Order: 1; Mounting Type: Surface Mount, MLCC; Operating Temperature: -55°C ~ 125°C; Package / Case: 0603 (1608 Metric); packaging: TapeAndReel; partid: 2138; Part Status: Active; price: 0.40; series: SMD Comm C0G; Size / Dimension: 0.063" L x 0.031" W (1.60mm x 0.80mm); Thickness (Max): 0.034" (0.87mm)
C137-C139 = CMP-2000-06205-2: CAP ALUM xUF 20% 25V SMD; Ripple Current (AC): 300mA; Leakage Current: 3uA; Dielectric Material: Aluminium; Impedance: 260mR; Life (Hours): 2000Hour; Max Operating Temperature: 105°C; Voltage Rating (DC): 25V; Packaging: Tape and Reel; Min Operating Temperature: -55°C; Capacitance: Cx; Ripple Current: 300mA; Mount: Surface Mount; Lead Free: Lead Free; Construction: Cylindrical; Voltage Rating: 25V; RoHS Compliant: Yes; Case/Package: Radial; Height: 6.2mm; Tolerance: 20%; Diameter: 8mm; Termination: SMD/SMT; Package Quantity: 1; Width: 8.3mm; REACH SVHC: No SVHC; Series: FK; Number of Pins: 2; Voltage: 25V; Radiation Hardening: No; Height - Seated (Max): 0.244inch; Length: 6.2mm; ESR (Equivalent Series Resistance): 260mR
D21 D24 D26 D30 = Zener_Diode_SOD323: 11V, 0,3W Zener diode
D22 D27 = CMP-07401-000031-1: TVS DIODE 20VWM 32.4VC SMC; Element Configuration: Single; Min Breakdown Voltage: 22.2V; Number of Elements: 1; Reverse Standoff Voltage: 20V; Peak Pulse Current: 46.3A; Direction: Bidirectional; Operating Supply Voltage: 3.5V; Max Surge Current: 200A; Breakdown Voltage: 25.5V; Leakage Current: 5uA; Clamping Voltage: 32.4V; Test Current: 1mA; Diode Type: ZENER; Power Line Protection: No; Peak Pulse Power: 1.5kW; Number of Bidirectional Channels: 1; Package Quantity: 3000; Resistor Type: Zener; Series: SMCJ; Min Operating Temperature: -55°C; Mount: Surface Mount; Max Reverse Leakage Current: 5uA; Case/Package: DO-214AB; Number of Channels: 1; Number of Pins: 2; Polarity: Bidirectional; Termination: SMD/SMT; RoHS Compliant: Yes; Radiation Hardening: No; Reverse Breakdown Voltage: 22.2V; Packaging: Tape and Reel; Max Operating Temperature: 150°C
D23 = Zener_Diode_SOD323: 6,2V, 0,4W Zener diode
D25 = BAS140W: Schottky diode; 0,1A; 40V; Published: 21-Mar-2003; LatestRevisionDate: 19-Mar-2004; LatestRevisionNote: Silkscreen size reduced.; DatasheetDocument: Oct-1999; PackageDocument: Sep-2000; PackageReference: SOD-323; Publisher: Altium Limited; ComponentLink1Description: Manufacturer Link; ComponentLink1URL: http://www.infineon.com/; ComponentLink2Description: Datasheet; ComponentLink2URL: http://www.infineon.com/upload/Document/cmc_upload/documents/009/386/bas70_bas170series_1.pdf
D28 = Zener_Diode_SOD323: 7,5V, 0,3W Zener diode
D29 D31 = Zener_Diode_SOD323: 3,3V, 0,3W Zener diode; SOD323
F2 F3 = 6,3x32_FUSE
FB11 = CMP-0686-00457-3: Chip Ferrite Bead, 0603, 1000Ω @ 100MHz, 0.5Ω, 25%, 450mA; Number of Circuits: 1; Max DC Current: 400mA; Shielding: Unshielded; DC Resistance (DCR): 500mR; Material: Steel; DC Resistance-Max: 700mR; Impedance: 1kR; Case Code (Imperial): 0603; Max Current Rating: 400mA; Frequency: 100MHz; Min Operating Temperature: -55°C; Case/Package: 0603; Depth: 0.8mm; Lead Free: Lead Free; Core Material: Ferrite; Current Rating: 400mA; Resistance: 500mR; Case Code (Metric): 1608; DC Current: 400mA; Package Quantity: 1; Packaging: Tape and Reel; Width: 0.8mm; Military Standard: Not; Height: 0.8mm; Series: BLM18A; Max Operating Temperature: 125°C; Tolerance: 25%; Termination: SMD/SMT; Test Frequency: 100MHz; Number of Lines: 1; Number of Pins: 2; REACH SVHC: No SVHC; Length: 1.6mm; Radiation Hardening: No
Q14 Q15 Q17 Q18 = CMP-00030-91482453-1: SQD40031EL_GE3 Transistor MOSFET P-CH 30V 100A 3-Pin TO-252; Max Junction Temperature (Tj): 175°C; Continuous Drain Current (ID): -100A; Drain to Source Resistance: 2.63mΩ; Turn-On Delay Time: 16ns; Drain to Source Voltage (Vdss): -30V; Turn-Off Delay Time: 126ns; Power Dissipation: 136W; Gate to Source Voltage (Vgs): 20V; Number of Channels: 1; RoHS: Non-Compliant; NexarPartId: 91482453; Max Operating Temperature: 175°C; Drain to Source Breakdown Voltage: -30V; Height: 2.507mm; Min Operating Temperature: -55°C
Q16 Q19 = CMP-1149-00026-1: N-Channel OptiMOS Small-Signal-Transistor, 60 V VDS, 0.3 A ID, -55 to 150 degC, PG-SOT23, Reel, Green; Manufacturer: Infineon; RDS (on) (max) (@4.5V): 4,000 mOhm; VDS (max): 60 V; IDpuls (max): 1.2Â A; QG: 0.4Â nC; RDS (on) (max): 3,000 mOhm; RthJA (max): 250 K/W; ID (max): 0.3Â A; VGS(th) (max): 2.5Â V; VGS(th) (min): 1.5Â V; Green: TRUE; Ptot (max): 0.5Â W; PackageDescription: 3-Pin Small Outline Transistor Package, 2.9 x 1.3 mm Body, 0.95 mm Pitch; Halogen-free: TRUE; ComponentLink2Description: Datasheet; ComponentLink1URL: http://www.infineon.com/; Packing: Reel; DatasheetVersion: Rev. 2.4; PartNumber: 2N7002; PackageReference: PG-SOT23; PackageVersion: Apr-08; ComponentLink3URL: http://www.infineon.com/dgdl/SOT23-Package_Overview.pdf?folderId=db3a30431936bc4b0119532290053c66&fileId=db3a30431936bc4b0119533468123c85; ComponentLink1Description: Manufacturer URL; Mounting Technology: Surface Mount; ComponentLink3Description: Package Specification; ComponentLink2URL: http://www.infineon.com/dgdl/2N7002_Rev2.4.pdf?folderId=db3a3043156fd573011622e10b5c1f67&fileId=db3a304319bc939a0119c2a9461e79e6
R73 R78 = RNCS0603BKE10K0: RES 100K OHM 1% 0,1W 0603; Manufacturer: Stackpole Electronics Inc; Power (Watts): 0.063W, 1/16W; Temperature Coefficient: ±25ppm/°C; Tolerance: ±0.1%; Part Number: RNCS0603BKE10K0; Value: 100k; Composition: Thin Film; Device Package: 0603 (1608 Metric); Features: Anti-Corrosive, Automotive AEC-Q200, Moisture Resistant; Height - Seated (Max): 0.022" (0.55mm); LastUpdated: 09.02.2024 20:43:37; Lifecycle Status: Active; Minimum Order: 1; Number of Terminations: 2; Operating Temperature: -55°C ~ 155°C; Package / Case: 0603 (1608 Metric); Packaging: TapeAndReel; PartId: 4838; Part Status: Active; Price: 0.06; Ratings: AEC-Q200; Resistance: 100k; Series: RNCS; Size / Dimension: 0.061" L x 0.031" W (1.55mm x 0.80mm); Supplier Device Package: 0603
R74 R79 = RNCS0603BKE10K0: RES 15K OHM 1% 0,1W 0603; Manufacturer: Stackpole Electronics Inc; Power (Watts): 0.063W, 1/16W; Temperature Coefficient: ±25ppm/°C; Tolerance: ±0.1%; Part Number: RNCS0603BKE10K0; Value: 15k; Composition: Thin Film; Device Package: 0603 (1608 Metric); Features: Anti-Corrosive, Automotive AEC-Q200, Moisture Resistant; Height - Seated (Max): 0.022" (0.55mm); LastUpdated: 09.02.2024 20:43:37; Lifecycle Status: Active; Minimum Order: 1; Number of Terminations: 2; Operating Temperature: -55°C ~ 155°C; Package / Case: 0603 (1608 Metric); Packaging: TapeAndReel; PartId: 4838; Part Status: Active; Price: 0.06; Ratings: AEC-Q200; Resistance: 15k; Series: RNCS; Size / Dimension: 0.061" L x 0.031" W (1.55mm x 0.80mm); Supplier Device Package: 0603
R75 R81 = RNCS0603BKE10K0: as R11 on sheet Elkapod_power_supply_conveter_module; Part Number: RNCS0603BKE10K0; Value: 4,7k; Composition: Thin Film; Device Package: 0603 (1608 Metric); Features: Anti-Corrosive, Automotive AEC-Q200, Moisture Resistant; Height - Seated (Max): 0.022" (0.55mm); LastUpdated: 09.02.2024 20:43:37; Lifecycle Status: Active; Minimum Order: 1; Number of Terminations: 2; Operating Temperature: -55°C ~ 155°C; Package / Case: 0603 (1608 Metric); Packaging: TapeAndReel; PartId: 4838; Part Status: Active; Price: 0.06; Ratings: AEC-Q200; Resistance: 4,7k; Series: RNCS; Size / Dimension: 0.061" L x 0.031" W (1.55mm x 0.80mm); Supplier Device Package: 0603
R76 R82 = RNCS0603BKE10K0: RES 68K OHM 1% 0,1W 0603; Manufacturer: Stackpole Electronics Inc; Power (Watts): 0.063W, 1/16W; Temperature Coefficient: ±25ppm/°C; Tolerance: ±0.1%; Part Number: RNCS0603BKE10K0; Value: 68k; Composition: Thin Film; Device Package: 0603 (1608 Metric); Features: Anti-Corrosive, Automotive AEC-Q200, Moisture Resistant; Height - Seated (Max): 0.022" (0.55mm); LastUpdated: 09.02.2024 20:43:37; Lifecycle Status: Active; Minimum Order: 1; Number of Terminations: 2; Operating Temperature: -55°C ~ 155°C; Package / Case: 0603 (1608 Metric); Packaging: TapeAndReel; PartId: 4838; Part Status: Active; Price: 0.06; Ratings: AEC-Q200; Resistance: 68k; Series: RNCS; Size / Dimension: 0.061" L x 0.031" W (1.55mm x 0.80mm); Supplier Device Package: 0603
R77 R83 = RNCS0603BKE10K0: RES 18K OHM 1% 0,1W 0603; Manufacturer: Stackpole Electronics Inc; Power (Watts): 0.063W, 1/16W; Temperature Coefficient: ±25ppm/°C; Tolerance: ±0.1%; Part Number: RNCS0603BKE10K0; Value: 18k; Composition: Thin Film; Device Package: 0603 (1608 Metric); Features: Anti-Corrosive, Automotive AEC-Q200, Moisture Resistant; Height - Seated (Max): 0.022" (0.55mm); LastUpdated: 09.02.2024 20:43:37; Lifecycle Status: Active; Minimum Order: 1; Number of Terminations: 2; Operating Temperature: -55°C ~ 155°C; Package / Case: 0603 (1608 Metric); Packaging: TapeAndReel; PartId: 4838; Part Status: Active; Price: 0.06; Ratings: AEC-Q200; Resistance: 18k; Series: RNCS; Size / Dimension: 0.061" L x 0.031" W (1.55mm x 0.80mm); Supplier Device Package: 0603
R80 R84 = RNCS0603BKE10K0: RES 2,7K OHM 1% 0,1W 0603; Manufacturer: Stackpole Electronics Inc; Power (Watts): 0.063W, 1/16W; Temperature Coefficient: ±25ppm/°C; Tolerance: ±0.1%; Part Number: RNCS0603BKE10K0; Value: 2,7k; Composition: Thin Film; Device Package: 0603 (1608 Metric); Features: Anti-Corrosive, Automotive AEC-Q200, Moisture Resistant; Height - Seated (Max): 0.022" (0.55mm); LastUpdated: 09.02.2024 20:43:37; Lifecycle Status: Active; Minimum Order: 1; Number of Terminations: 2; Operating Temperature: -55°C ~ 155°C; Package / Case: 0603 (1608 Metric); Packaging: TapeAndReel; PartId: 4838; Part Status: Active; Price: 0.06; Ratings: AEC-Q200; Resistance: 2,7k; Series: RNCS; Size / Dimension: 0.061" L x 0.031" W (1.55mm x 0.80mm); Supplier Device Package: 0603
TP6 = Keystone 5006 Test Point: Keystone 5006 Test Point (BLACK)
U20-U22 = CMP-0054-00268-3: Single Channel, 50 to 200 kSPS, 12-Bit A/D Converter, 6-pin SOT-23; Manufacturer: Texas Instruments; PackageTopMarking: X07C*XTT; CompType: ADC IC; PowerWise: Y; Code_IPC: SOT26A-6; PackageReference: DBV0006A; ComponentLink1Description: Datasheet URL; PinCount: 6; ComponentLink1URL: http://www.ti.com/general/docs/lit/getliterature.tsp?genericPartNumber=ADC121S021&fileType=pdf; PackageDescription: Molded SOT-23, .115 x .063 x .040in Body, 6 Lead, .0375in in Pitch; RoHS: N; Code_JEDEC: MO-178-AB
U23 = NCP51460SN33T1G: Low power precision voltage reference; Iout = 20mA

## Sheet Current_measurement_circuit.SchDoc
size A4; SheetNumber: 6; SheetTotal: 6
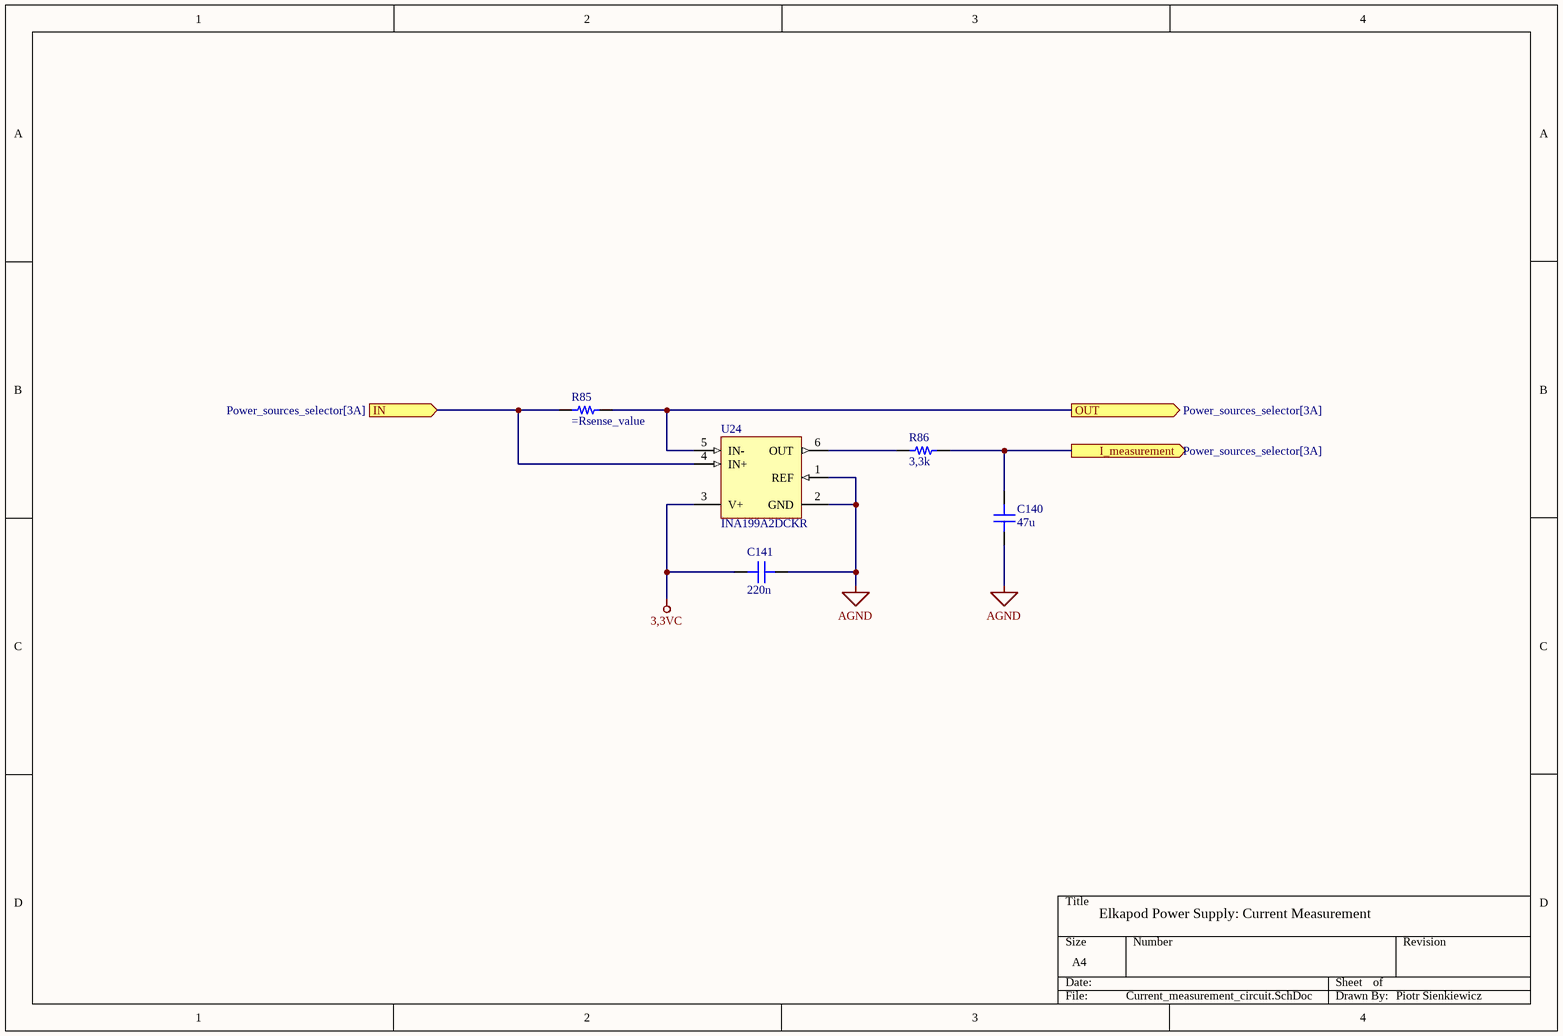
[diagram p2: Current_measurement_circuit.SchDoc]

### Parts
C140  47u  [CAP 0603_1608]
C141  220n  [CAP 0603_1608]
R85  (no value)  [STACKPOLE CSM2512]
R86  3,3k  [RES 0603_1608]
U24  INA199A2DCKR  [DCK0006A_N]

### Ports
I_measurement (out, see Power_sources_selector[3A]), IN (in, see Power_sources_selector[3A]), OUT (out, see Power_sources_selector[3A])

### Nets
3,3VC: C141.2 U24.3(V+)
AGND: C140.1 C141.1 U24.1(REF) U24.2(GND)
U_SUP: R85.1 U24.5(IN-) ; port OUT
NetC140_2: C140.2 R86.2 ; port I_measurement
NetQ15_4: R85.2 U24.4(IN+) ; port IN
NetR86_1: R86.1 U24.6(OUT)

### Notes on the sheet
- Elkapod Power Supply: Current Measurement
- Piotr Sienkiewicz

### Library data of the parts
C140 = C0603C272F3GAC7867: as C3 on sheet Elkapod_power_supply_conveter_module; Part Number: C0603C272F3GAC7867; Value: 47u; Applications: General Purpose; Capacitance: 47u; componentlink1description: Datasheet; componentlink1url: https://api.kemet.com/component-edge/download/datasheet/C0603C272F3GACTU.pdf; componentlink2description: DigiKey Link; componentlink2url: https://www.digikey.com/en/products/detail/kemet/C0603C272F3GAC7867/2200413; Device Package: 0603 (1608 Metric); Features: Low ESL; lastupdated: 09.02.2024 20:10:30; Lifecycle Status: Active; Minimum Order: 1; Mounting Type: Surface Mount, MLCC; Operating Temperature: -55°C ~ 125°C; Package / Case: 0603 (1608 Metric); packaging: TapeAndReel; partid: 2138; Part Status: Active; price: 0.40; series: SMD Comm C0G; Size / Dimension: 0.063" L x 0.031" W (1.60mm x 0.80mm); Thickness (Max): 0.034" (0.87mm)
C141 = C0603C272F3GAC7867: as C4 on sheet Elkapod_power_supply_conveter_module; Part Number: C0603C272F3GAC7867; Value: 220n; Applications: General Purpose; Capacitance: 220n; componentlink1description: Datasheet; componentlink1url: https://api.kemet.com/component-edge/download/datasheet/C0603C272F3GACTU.pdf; componentlink2description: DigiKey Link; componentlink2url: https://www.digikey.com/en/products/detail/kemet/C0603C272F3GAC7867/2200413; Device Package: 0603 (1608 Metric); Features: Low ESL; lastupdated: 09.02.2024 20:10:30; Lifecycle Status: Active; Minimum Order: 1; Mounting Type: Surface Mount, MLCC; Operating Temperature: -55°C ~ 125°C; Package / Case: 0603 (1608 Metric); packaging: TapeAndReel; partid: 2138; Part Status: Active; price: 0.40; series: SMD Comm C0G; Size / Dimension: 0.063" L x 0.031" W (1.60mm x 0.80mm); Thickness (Max): 0.034" (0.87mm); Voltage - Rated: 25V
R85 = CSM2512FT20L0: RES 1% 3W 2512; manufacturer: Stackpole Electronics Inc; Temperature Coefficient: ±50ppm/°C; value: 20 mOhms; Part Number: CSM2512FT20L0; componentlink1description: Datasheet; componentlink1url: https://www.seielect.com/Catalog/SEI-CSM.PDF; componentlink2description: DigiKey Link; componentlink2url: https://www.digikey.com/en/products/detail/stackpole-electronics-inc/CSM2512FT20L0/6270239; Composition: Metal Element; Device Package: 2512 (6332 Metric); Features: Current Sense; Height - Seated (Max): 0.035" (0.90mm); lastupdated: 03.06.2024 20:27:03; Lifecycle Status: Active; Minimum Order: 4000; Number of Terminations: 2; Operating Temperature: -55°C ~ 170°C; Package / Case: 2512 (6332 Metric); packaging: TapeAndReel; Part Status: Active; Power (Watts): 3W; price: 0.19; Resistance: =Rsense_value; series: CSM; Size / Dimension: 0.252" L x 0.126" W (6.40mm x 3.20mm); Supplier Device Package: 2512; Tolerance: ±1%
R86 = RNCS0603BKE10K0: RES 3,3K OHM 1% 0,1W 0603; Manufacturer: Stackpole Electronics Inc; Power (Watts): 0.063W, 1/16W; Temperature Coefficient: ±25ppm/°C; Tolerance: ±0.1%; Part Number: RNCS0603BKE10K0; Value: 3,3k; Composition: Thin Film; Device Package: 0603 (1608 Metric); Features: Anti-Corrosive, Automotive AEC-Q200, Moisture Resistant; Height - Seated (Max): 0.022" (0.55mm); LastUpdated: 09.02.2024 20:43:37; Lifecycle Status: Active; Minimum Order: 1; Number of Terminations: 2; Operating Temperature: -55°C ~ 155°C; Package / Case: 0603 (1608 Metric); Packaging: TapeAndReel; PartId: 4838; Part Status: Active; Price: 0.06; Ratings: AEC-Q200; Resistance: 3,3k; Series: RNCS; Size / Dimension: 0.061" L x 0.031" W (1.55mm x 0.80mm); Supplier Device Package: 0603
U24 = CMP-0704-00046-2: Voltage Output, High or Low Side Measurement, Bi-Directional Zero-Drift Series, 2.7 to 26 V, -40 to 125 degC, 6-pin SOT23 (DCK6), Green (RoHS & no Sb/Br); Rating: Catalog; CMRR(Min)(dB): 100; Quiescent Current (+/-)(Typ)(mA): 0.065; Input Offset Drift (+/-)(Max)(uV/Degrees Celsius): 0.5; Vs(Max)(V): 26; SubFamily: Current Shunt Monitor; Small-Signal Bandwidth(Typ)(MHz): 0.03; Vs(Min)(V): 2.7; Input Offset (+/-)(Max)(uV): 150; Common Mode Range(Min)(V): -0.3; PackageVersion: 4093553-4/G, 01/2007; PartNumber: INA199A2DCKR; DatasheetVersion: SBOS469D; ComponentLink2URL: http://www.ti.com/general/docs/lit/getliterature.tsp?genericPartNumber=INA199A2&fileType=pdf; Gain(V/V): 100; ComponentLink1Description: Manufacturer URL; PackageReference: DCK0006A; ComponentLink3Description: Package Specification; ComponentLink1URL: http://www.ti.com/; ComponentLink3URL: http://www.ti.com/lit/ds/symlink/ina212-q1.pdf; ComponentLink2Description: Datasheet; PackageDescription: 6-Pin Plastic Small Outline, Body 2 x 1.25 mm, Pitch 0.65 mm; Common Mode Range(Max)(V): 26; Mounting Technology: Surface Mount; Output Type: Voltage; Code_JEDEC: MO-203; Eco-Plan: Green (RoHS & no Sb/Br)